# EAGLE design LuMini_8X8 (EAGLE 9.1.0)
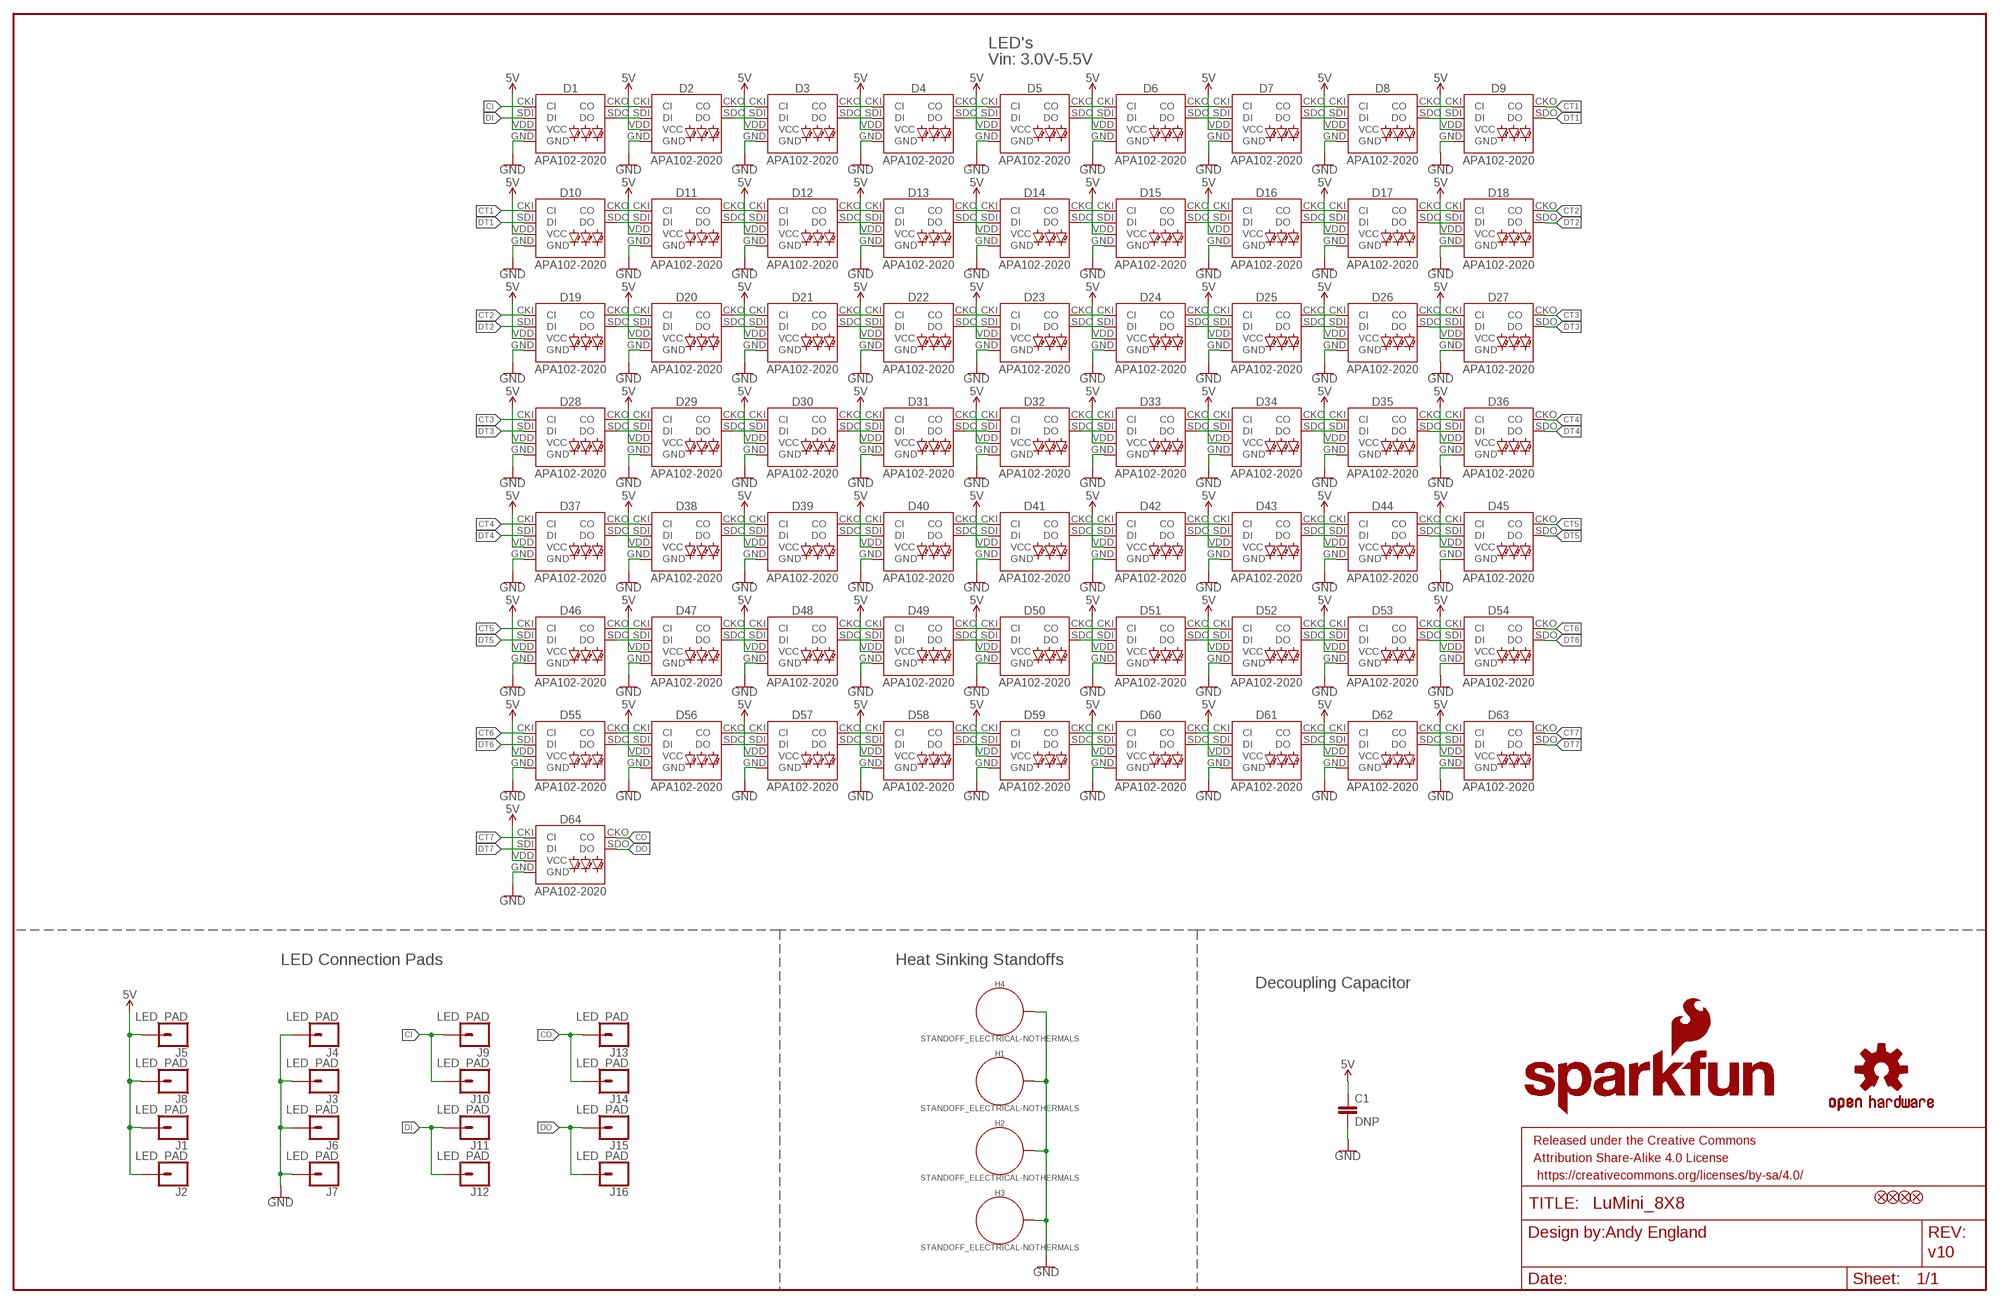
[diagram p0: schematic, sheet 1]

## Parts
C1  DNP  4.7UF-1206-16V-(+80/-20%)  [1206]
D1  APA102-2020  [APA102-2020]
D2  APA102-2020  [APA102-2020]
D3  APA102-2020  [APA102-2020]
D4  APA102-2020  [APA102-2020]
D5  APA102-2020  [APA102-2020]
D6  APA102-2020  [APA102-2020]
D7  APA102-2020  [APA102-2020]
D8  APA102-2020  [APA102-2020]
D9  APA102-2020  [APA102-2020]
D10  APA102-2020  [APA102-2020]
D11  APA102-2020  [APA102-2020]
D12  APA102-2020  [APA102-2020]
D13  APA102-2020  [APA102-2020]
D14  APA102-2020  [APA102-2020]
D15  APA102-2020  [APA102-2020]
D16  APA102-2020  [APA102-2020]
D17  APA102-2020  [APA102-2020]
D18  APA102-2020  [APA102-2020]
D19  APA102-2020  [APA102-2020]
D20  APA102-2020  [APA102-2020]
D21  APA102-2020  [APA102-2020]
D22  APA102-2020  [APA102-2020]
D23  APA102-2020  [APA102-2020]
D24  APA102-2020  [APA102-2020]
D25  APA102-2020  [APA102-2020]
D26  APA102-2020  [APA102-2020]
D27  APA102-2020  [APA102-2020]
D28  APA102-2020  [APA102-2020]
D29  APA102-2020  [APA102-2020]
D30  APA102-2020  [APA102-2020]
D31  APA102-2020  [APA102-2020]
D32  APA102-2020  [APA102-2020]
D33  APA102-2020  [APA102-2020]
D34  APA102-2020  [APA102-2020]
D35  APA102-2020  [APA102-2020]
D36  APA102-2020  [APA102-2020]
D37  APA102-2020  [APA102-2020]
D38  APA102-2020  [APA102-2020]
D39  APA102-2020  [APA102-2020]
D40  APA102-2020  [APA102-2020]
D41  APA102-2020  [APA102-2020]
D42  APA102-2020  [APA102-2020]
D43  APA102-2020  [APA102-2020]
D44  APA102-2020  [APA102-2020]
D45  APA102-2020  [APA102-2020]
D46  APA102-2020  [APA102-2020]
D47  APA102-2020  [APA102-2020]
D48  APA102-2020  [APA102-2020]
D49  APA102-2020  [APA102-2020]
D50  APA102-2020  [APA102-2020]
D51  APA102-2020  [APA102-2020]
D52  APA102-2020  [APA102-2020]
D53  APA102-2020  [APA102-2020]
D54  APA102-2020  [APA102-2020]
D55  APA102-2020  [APA102-2020]
D56  APA102-2020  [APA102-2020]
D57  APA102-2020  [APA102-2020]
D58  APA102-2020  [APA102-2020]
D59  APA102-2020  [APA102-2020]
D60  APA102-2020  [APA102-2020]
D61  APA102-2020  [APA102-2020]
D62  APA102-2020  [APA102-2020]
D63  APA102-2020  [APA102-2020]
D64  APA102-2020  [APA102-2020]
FD1  FIDUCIALUFIDUCIAL  [FIDUCIAL-MICRO]
FD2  FIDUCIALUFIDUCIAL  [FIDUCIAL-MICRO]
FD3  FIDUCIALUFIDUCIAL  [FIDUCIAL-MICRO]
FD4  FIDUCIALUFIDUCIAL  [FIDUCIAL-MICRO]
FRAME1  FRAME-LEDGER  [CREATIVE_COMMONS]
H1  STANDOFF_ELECTRICAL-NOTHERMALS  [STANDOFF-ELECTRICAL-NOTHERMALS]
H2  STANDOFF_ELECTRICAL-NOTHERMALS  [STANDOFF-ELECTRICAL-NOTHERMALS]
H3  STANDOFF_ELECTRICAL-NOTHERMALS  [STANDOFF-ELECTRICAL-NOTHERMALS]
H4  STANDOFF_ELECTRICAL-NOTHERMALS  [STANDOFF-ELECTRICAL-NOTHERMALS]
J1  LED_PAD  [CIRCULARPAD]
J2  LED_PAD  [CIRCULARPAD]
J3  LED_PAD  [CIRCULARPAD]
J4  LED_PAD  [CIRCULARPAD]
J5  LED_PAD  [CIRCULARPAD]
J6  LED_PAD  [CIRCULARPAD]
J7  LED_PAD  [CIRCULARPAD]
J8  LED_PAD  [CIRCULARPAD]
J9  LED_PAD  [CIRCULARPAD]
J10  LED_PAD  [CIRCULARPAD]
J11  LED_PAD  [CIRCULARPAD]
J12  LED_PAD  [CIRCULARPAD]
J13  LED_PAD  [CIRCULARPAD]
J14  LED_PAD  [CIRCULARPAD]
J15  LED_PAD  [CIRCULARPAD]
J16  LED_PAD  [CIRCULARPAD]
LOGO1  SFE_LOGO_NAME_FLAME.1_INCH  [SFE_LOGO_NAME_FLAME_.1]
LOGO2  OSHW-LOGOS  [OSHW-LOGO-S]

## Nets
5V: C1.1 D1.VDD(VCC) D2.VDD(VCC) D3.VDD(VCC) D4.VDD(VCC) D5.VDD(VCC) D6.VDD(VCC) D7.VDD(VCC) D8.VDD(VCC) D9.VDD(VCC) D10.VDD(VCC) D11.VDD(VCC) D12.VDD(VCC) D13.VDD(VCC) D14.VDD(VCC) D15.VDD(VCC) D16.VDD(VCC) D17.VDD(VCC) D18.VDD(VCC) D19.VDD(VCC) D20.VDD(VCC) D21.VDD(VCC) D22.VDD(VCC) D23.VDD(VCC) D24.VDD(VCC) D25.VDD(VCC) D26.VDD(VCC) D27.VDD(VCC) D28.VDD(VCC) D29.VDD(VCC) D30.VDD(VCC) D31.VDD(VCC) D32.VDD(VCC) D33.VDD(VCC) D34.VDD(VCC) D35.VDD(VCC) D36.VDD(VCC) D37.VDD(VCC) D38.VDD(VCC) D39.VDD(VCC) D40.VDD(VCC) D41.VDD(VCC) D42.VDD(VCC) D43.VDD(VCC) D44.VDD(VCC) D45.VDD(VCC) D46.VDD(VCC) D47.VDD(VCC) D48.VDD(VCC) D49.VDD(VCC) D50.VDD(VCC) D51.VDD(VCC) D52.VDD(VCC) D53.VDD(VCC) D54.VDD(VCC) D55.VDD(VCC) D56.VDD(VCC) D57.VDD(VCC) D58.VDD(VCC) D59.VDD(VCC) D60.VDD(VCC) D61.VDD(VCC) D62.VDD(VCC) D63.VDD(VCC) D64.VDD(VCC) J1.P$1 J1.P$2 J2.P$1 J2.P$2 J5.P$1 J5.P$2 J8.P$1 J8.P$2
CI: D1.CKI(CI) J9.P$1 J9.P$2 J10.P$1 J10.P$2
CO: D64.CKO(CO) J13.P$1 J13.P$2 J14.P$1 J14.P$2
CT1: D9.CKO(CO) D10.CKI(CI)
CT2: D18.CKO(CO) D19.CKI(CI)
CT3: D27.CKO(CO) D28.CKI(CI)
CT4: D36.CKO(CO) D37.CKI(CI)
CT5: D45.CKO(CO) D46.CKI(CI)
CT6: D54.CKO(CO) D55.CKI(CI)
CT7: D63.CKO(CO) D64.CKI(CI)
DI: D1.SDI(DI) J11.P$1 J11.P$2 J12.P$1 J12.P$2
DO: D64.SDO(DO) J15.P$1 J15.P$2 J16.P$1 J16.P$2
DT1: D9.SDO(DO) D10.SDI(DI)
DT2: D18.SDO(DO) D19.SDI(DI)
DT3: D27.SDO(DO) D28.SDI(DI)
DT4: D36.SDO(DO) D37.SDI(DI)
DT5: D45.SDO(DO) D46.SDI(DI)
DT6: D54.SDO(DO) D55.SDI(DI)
DT7: D63.SDO(DO) D64.SDI(DI)
GND: C1.2 D1.GND D2.GND D3.GND D4.GND D5.GND D6.GND D7.GND D8.GND D9.GND D10.GND D11.GND D12.GND D13.GND D14.GND D15.GND D16.GND D17.GND D18.GND D19.GND D20.GND D21.GND D22.GND D23.GND D24.GND D25.GND D26.GND D27.GND D28.GND D29.GND D30.GND D31.GND D32.GND D33.GND D34.GND D35.GND D36.GND D37.GND D38.GND D39.GND D40.GND D41.GND D42.GND D43.GND D44.GND D45.GND D46.GND D47.GND D48.GND D49.GND D50.GND D51.GND D52.GND D53.GND D54.GND D55.GND D56.GND D57.GND D58.GND D59.GND D60.GND D61.GND D62.GND D63.GND D64.GND H1.P1 H2.P1 H3.P1 H4.P1 J3.P$1 J3.P$2 J4.P$1 J4.P$2 J6.P$1 J6.P$2 J7.P$1 J7.P$2
N$1: D1.SDO(DO) D2.SDI(DI)
N$2: D1.CKO(CO) D2.CKI(CI)
N$5: D2.SDO(DO) D3.SDI(DI)
N$6: D2.CKO(CO) D3.CKI(CI)
N$7: D3.SDO(DO) D4.SDI(DI)
N$8: D3.CKO(CO) D4.CKI(CI)
N$9: D4.SDO(DO) D5.SDI(DI)
N$10: D4.CKO(CO) D5.CKI(CI)
N$11: D5.SDO(DO) D6.SDI(DI)
N$12: D5.CKO(CO) D6.CKI(CI)
N$13: D6.SDO(DO) D7.SDI(DI)
N$14: D6.CKO(CO) D7.CKI(CI)
N$15: D7.SDO(DO) D8.SDI(DI)
N$16: D7.CKO(CO) D8.CKI(CI)
N$17: D8.SDO(DO) D9.SDI(DI)
N$18: D8.CKO(CO) D9.CKI(CI)
N$21: D10.SDO(DO) D11.SDI(DI)
N$22: D10.CKO(CO) D11.CKI(CI)
N$23: D11.SDO(DO) D12.SDI(DI)
N$24: D11.CKO(CO) D12.CKI(CI)
N$25: D12.SDO(DO) D13.SDI(DI)
N$26: D12.CKO(CO) D13.CKI(CI)
N$27: D13.SDO(DO) D14.SDI(DI)
N$28: D13.CKO(CO) D14.CKI(CI)
N$29: D14.SDO(DO) D15.SDI(DI)
N$30: D14.CKO(CO) D15.CKI(CI)
N$31: D15.SDO(DO) D16.SDI(DI)
N$32: D15.CKO(CO) D16.CKI(CI)
N$33: D16.SDO(DO) D17.SDI(DI)
N$34: D16.CKO(CO) D17.CKI(CI)
N$35: D17.SDO(DO) D18.SDI(DI)
N$36: D17.CKO(CO) D18.CKI(CI)
N$37: D19.SDO(DO) D20.SDI(DI)
N$38: D19.CKO(CO) D20.CKI(CI)
N$39: D20.SDO(DO) D21.SDI(DI)
N$40: D20.CKO(CO) D21.CKI(CI)
N$41: D21.SDO(DO) D22.SDI(DI)
N$42: D21.CKO(CO) D22.CKI(CI)
N$43: D22.SDO(DO) D23.SDI(DI)
N$44: D22.CKO(CO) D23.CKI(CI)
N$45: D23.SDO(DO) D24.SDI(DI)
N$46: D23.CKO(CO) D24.CKI(CI)
N$47: D24.SDO(DO) D25.SDI(DI)
N$48: D24.CKO(CO) D25.CKI(CI)
N$49: D25.SDO(DO) D26.SDI(DI)
N$50: D25.CKO(CO) D26.CKI(CI)
N$51: D26.SDO(DO) D27.SDI(DI)
N$52: D26.CKO(CO) D27.CKI(CI)
N$53: D28.SDO(DO) D29.SDI(DI)
N$54: D28.CKO(CO) D29.CKI(CI)
N$55: D29.SDO(DO) D30.SDI(DI)
N$56: D29.CKO(CO) D30.CKI(CI)
N$57: D30.SDO(DO) D31.SDI(DI)
N$58: D30.CKO(CO) D31.CKI(CI)
N$59: D31.SDO(DO) D32.SDI(DI)
N$60: D31.CKO(CO) D32.CKI(CI)
N$61: D32.SDO(DO) D33.SDI(DI)
N$62: D32.CKO(CO) D33.CKI(CI)
N$63: D33.SDO(DO) D34.SDI(DI)
N$64: D33.CKO(CO) D34.CKI(CI)
N$65: D34.SDO(DO) D35.SDI(DI)
N$66: D34.CKO(CO) D35.CKI(CI)
N$67: D35.SDO(DO) D36.SDI(DI)
N$68: D35.CKO(CO) D36.CKI(CI)
N$69: D37.SDO(DO) D38.SDI(DI)
N$70: D37.CKO(CO) D38.CKI(CI)
N$71: D38.SDO(DO) D39.SDI(DI)
N$72: D38.CKO(CO) D39.CKI(CI)
N$73: D39.SDO(DO) D40.SDI(DI)
N$74: D39.CKO(CO) D40.CKI(CI)
N$75: D40.SDO(DO) D41.SDI(DI)
N$76: D40.CKO(CO) D41.CKI(CI)
N$77: D41.SDO(DO) D42.SDI(DI)
N$78: D41.CKO(CO) D42.CKI(CI)
N$79: D42.SDO(DO) D43.SDI(DI)
N$80: D42.CKO(CO) D43.CKI(CI)
N$81: D43.SDO(DO) D44.SDI(DI)
N$82: D43.CKO(CO) D44.CKI(CI)
N$83: D44.SDO(DO) D45.SDI(DI)
N$84: D44.CKO(CO) D45.CKI(CI)
N$85: D46.SDO(DO) D47.SDI(DI)
N$86: D46.CKO(CO) D47.CKI(CI)
N$87: D47.SDO(DO) D48.SDI(DI)
N$88: D47.CKO(CO) D48.CKI(CI)
N$89: D48.SDO(DO) D49.SDI(DI)
N$90: D48.CKO(CO) D49.CKI(CI)
N$91: D49.SDO(DO) D50.SDI(DI)
N$92: D49.CKO(CO) D50.CKI(CI)
N$93: D50.SDO(DO) D51.SDI(DI)
N$94: D50.CKO(CO) D51.CKI(CI)
N$95: D51.SDO(DO) D52.SDI(DI)
N$96: D51.CKO(CO) D52.CKI(CI)
N$97: D52.SDO(DO) D53.SDI(DI)
N$98: D52.CKO(CO) D53.CKI(CI)
N$99: D53.SDO(DO) D54.SDI(DI)
N$100: D53.CKO(CO) D54.CKI(CI)
N$101: D55.SDO(DO) D56.SDI(DI)
N$102: D55.CKO(CO) D56.CKI(CI)
N$103: D56.SDO(DO) D57.SDI(DI)
N$104: D56.CKO(CO) D57.CKI(CI)
N$105: D57.SDO(DO) D58.SDI(DI)
N$106: D57.CKO(CO) D58.CKI(CI)
N$107: D58.SDO(DO) D59.SDI(DI)
N$108: D58.CKO(CO) D59.CKI(CI)
N$109: D59.SDO(DO) D60.SDI(DI)
N$110: D59.CKO(CO) D60.CKI(CI)
N$111: D60.SDO(DO) D61.SDI(DI)
N$112: D60.CKO(CO) D61.CKI(CI)
N$113: D61.SDO(DO) D62.SDI(DI)
N$114: D61.CKO(CO) D62.CKI(CI)
N$115: D62.SDO(DO) D63.SDI(DI)
N$116: D62.CKO(CO) D63.CKI(CI)

## Notes on the sheet
- LED's
- Vin: 3.0V-5.5V
- LED Connection Pads | Heat Sinking Standoffs
- Decoupling Capacitor
- Andy England
- v10

## Library data of the parts
C1 = SparkFun-Capacitors:4.7UF: 4.7µF ceramic capacitors A capacitor is a passive two-terminal electrical component used to store electrical energy temporarily in an electric field.; PROD_ID: CAP-10300; VALUE: 4.7uF
D1-D64 = SparkFun-LED:APA102: APA102 Addressable RGB LED Used in manufacturing of various products at SparkFun Packages: 5050 2020 SparkFun Products: SparkFun Lumenati Boards <https://www.sparkfun.com/categories/405>; PROD_ID: DIO-13883
FD1-FD4 = SparkFun-Aesthetics:FIDUCIAL: Fiducial Alignment Points Point-of-reference for pick-and-place machines and other optical instruments.
FRAME1 = SparkFun-Aesthetics:FRAME-LEDGER: Schematic Frame - Ledger Standard 11x14 US Ledger frame
H1-H4 = SparkFun-Hardware:STANDOFF_ELECTRICAL: Stand Off Drill holes with an electrical connection. For example, use these to ground your board to a chassis. Example SparkFun Products Screw - Phillips Head (1/4", 4-40, 10 pack) <https://www.sparkfun.com/products/10453> (PRT-10453) Screw - Phillips Head (1/2", 4-40, 10 pack) <https://www.sparkfun.com/products/10452> (PRT-10452) Screw - Phillips Head (3/4", 4-40, 10 pack) <https://www.sparkfun.com/products/10451> (PRT-10451) Screw - Phillips Head (1", 4-40, 10 pack) <https://www.sparkfun.com/products/10450> (PRT-10450)
J1-J16 = SparkFun-Connectors:LED_PAD: LuMini 8X8 Solder Pad
LOGO1 = SparkFun-Aesthetics:SFE_LOGO_NAME_FLAME: SparkFun Font Logo w/ Flame This is the SparkFun full logo. The logo on the schematic will always be the same size; the package variant is the height of the flame part of the logo. Default layer for the logo on the board is tSilk.
LOGO2 = SparkFun-Aesthetics:OSHW-LOGO: Open-Source Hardware (OSHW) Logo This logo indicates the piece of hardware it is found on incorporates a OSHW license and/or adheres to the definition of open source hardware found here: http://freedomdefined.org/OSHW

## Board
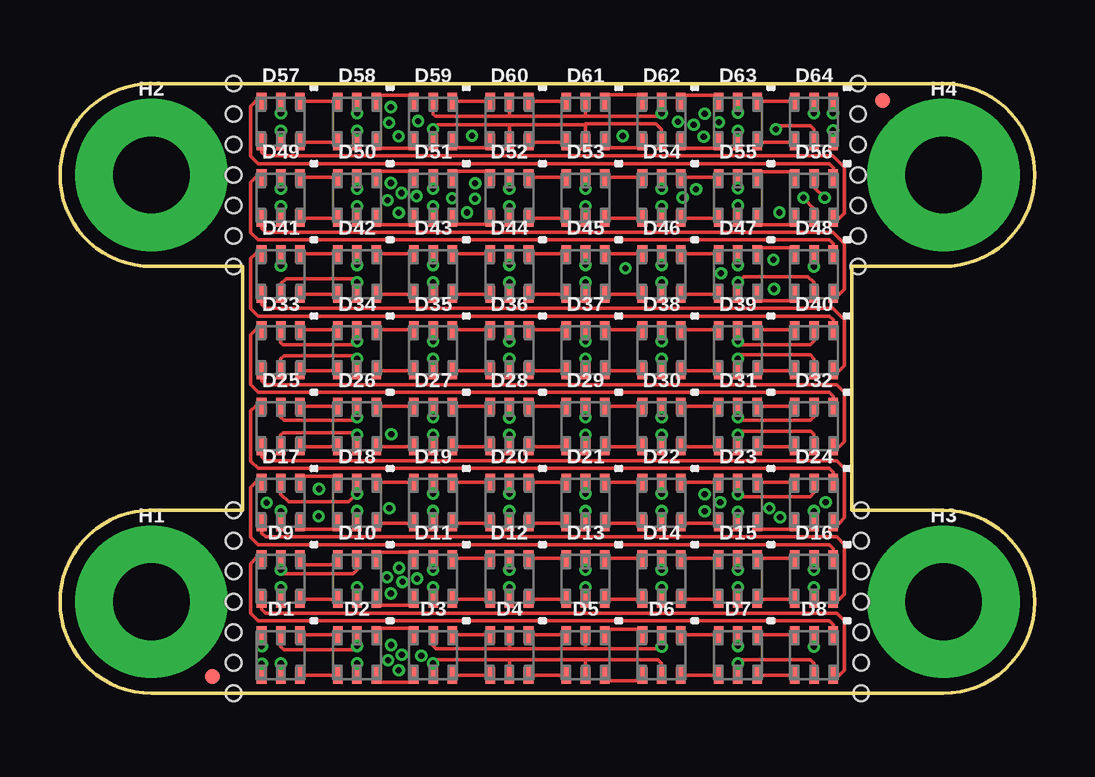
[diagram p1: board, top side]
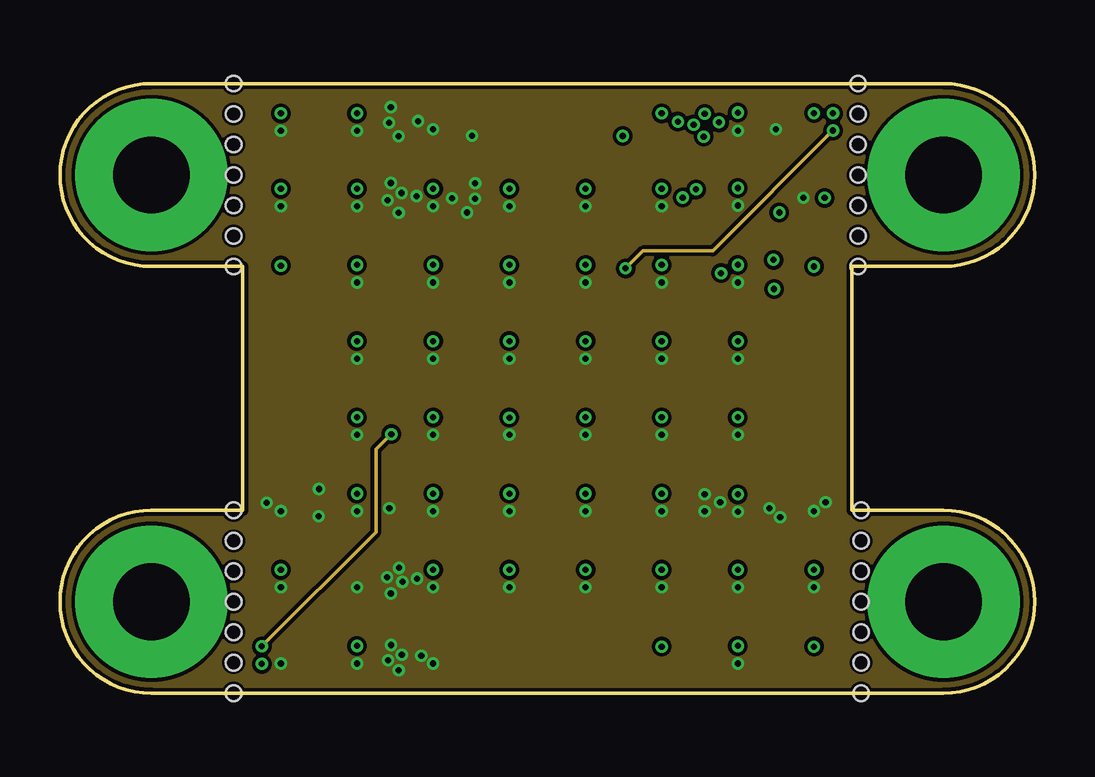
[diagram p2: board, inner layer Route2]
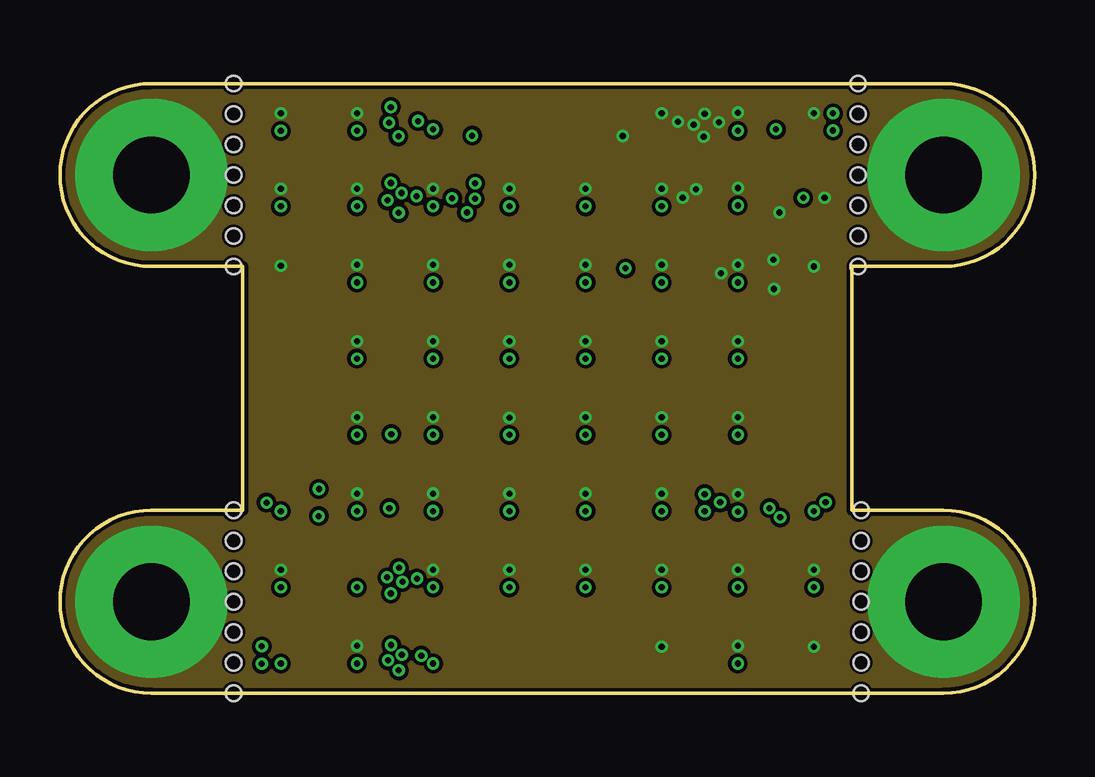
[diagram p3: board, inner layer Route15]
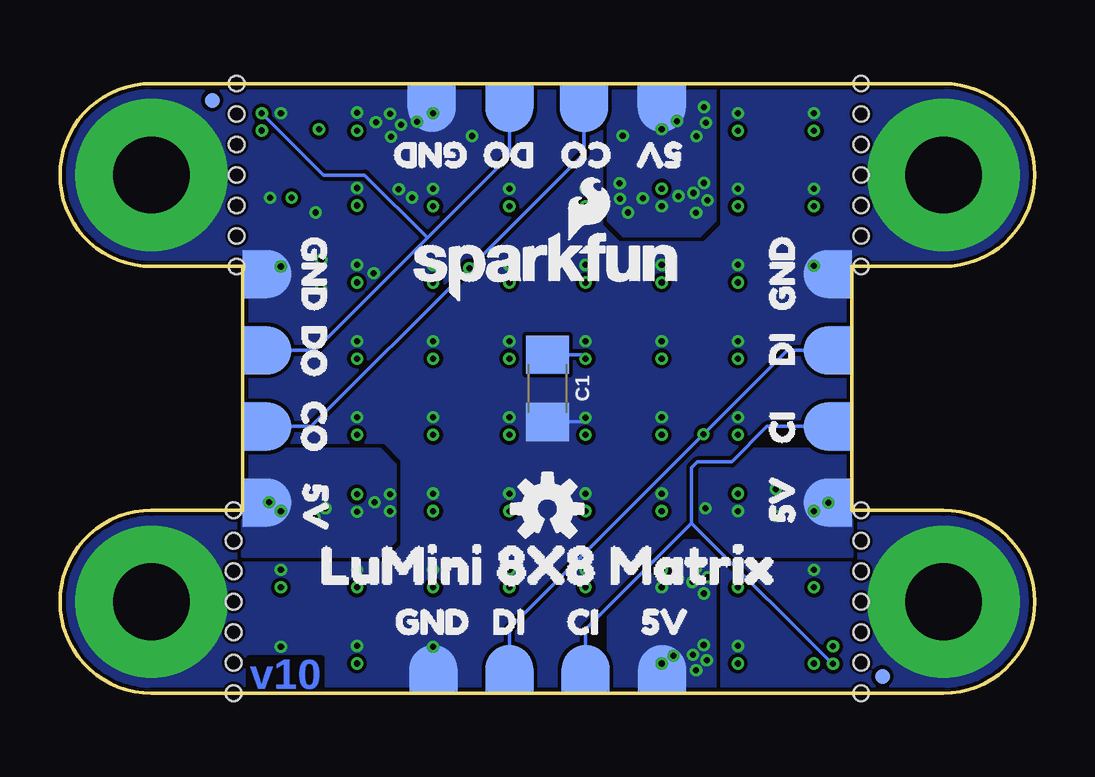
[diagram p4: board, bottom side, seen from below]

Size 40.64 x 25.4 mm. Coordinates in mm from the lower left corner, seen from the top.
Outline: 3.81,0 36.83,0 arc90 40.64,3.81 arc90 36.83,7.62 33.02,7.62 33.02,17.78 36.83,17.78 arc90 40.64,21.59 arc90 36.83,25.4 3.81,25.4 arc90 0,21.59 arc90 3.81,17.78 7.62,17.78 7.62,7.62 3.81,7.62 arc90 0,3.81 arc90 3.81,0
Copper layers (1*2*15*16): Top 0.035559375mm / dielectric 0.47751875mm / Route2 0.035559375mm / dielectric 0.47751875mm / Route15 0.035559375mm / dielectric 0.47751875mm / Bottom 0.035559375mm
Design rules "SparkFun-4-layer-FAB-LIMIT *": minimum track width 6mil, minimum drill 6mil, track to track 6mil, track to pad 6mil, pad to pad 6mil, via to via 6mil, smd to smd 6mil, copper to edge 6mil, drill to drill 6mil, minimum pad ring 5mil, minimum via ring 5mil, stop-mask expansion 1mil, vias tented up to drill 25mil, thermal gap 10mil
Holes 0.64 mm at 7.24,21.59 7.24,22.86 7.24,24.13 7.24,25.4 7.24,20.32 7.24,19.05 7.24,17.78 7.24,3.81 7.24,5.08 7.24,6.35 7.24,7.62 7.24,2.54 7.24,1.27 7.24,0 33.27,21.59 33.27,22.86 33.27,24.13 33.27,25.4 33.27,20.32 33.27,19.05 33.27,17.78 33.4,3.81 33.4,5.08 33.4,6.35 33.4,7.62 33.4,2.54 33.4,1.27 33.4,0

### Footprints (pad centres in the part's own frame; a part is rotated, then mirrored left to right if it is on the bottom)
1206 = smd 1.6 x 1.8: 1 -1.4,0; 2 1.4,0
APA102-2020 = smd 0.4 x 0.7: CKI -0.8,-0.85; CKO 0.8,-0.85; GND 0,0.85; SDI -0.8,0.85; SDO 0.8,0.85; VDD 0,-0.85
FIDUCIAL-MICRO = smd 0.635 x 0.635: 1 0,0
STANDOFF-ELECTRICAL-NOTHERMALS = drill 3.2 pad 6.35: P1 0,0
CIRCULARPAD = smd 2 x 2: P$1 0,0 | smd 2.007 x 1.016: P$2 0,-0.508

### Placement (x,y rotation side)
C1  20.32,12.7 270 bottom
D1  9.21,1.59 0 top
D2  12.38,1.59 0 top
D3  15.56,1.59 0 top
D4  18.73,1.59 0 top
D5  21.91,1.59 0 top
D6  25.08,1.59 0 top
D7  28.26,1.59 0 top
D8  31.43,1.59 0 top
D9  9.21,4.76 0 top
D10  12.38,4.76 0 top
D11  15.56,4.76 0 top
D12  18.73,4.76 0 top
D13  21.91,4.76 0 top
D14  25.08,4.76 0 top
D15  28.26,4.76 0 top
D16  31.43,4.76 0 top
D17  9.21,7.94 0 top
D18  12.38,7.94 0 top
D19  15.56,7.94 0 top
D20  18.73,7.94 0 top
D21  21.91,7.94 0 top
D22  25.08,7.94 0 top
D23  28.26,7.94 0 top
D24  31.43,7.94 0 top
D25  9.21,11.11 0 top
D26  12.38,11.11 0 top
D27  15.56,11.11 0 top
D28  18.73,11.11 0 top
D29  21.91,11.11 0 top
D30  25.08,11.11 0 top
D31  28.26,11.11 0 top
D32  31.43,11.11 0 top
D33  9.21,14.29 0 top
D34  12.38,14.29 0 top
D35  15.56,14.29 0 top
D36  18.73,14.29 0 top
D37  21.91,14.29 0 top
D38  25.08,14.29 0 top
D39  28.26,14.29 0 top
D40  31.43,14.29 0 top
D41  9.21,17.46 0 top
D42  12.38,17.46 0 top
D43  15.56,17.46 0 top
D44  18.73,17.46 0 top
D45  21.91,17.46 0 top
D46  25.08,17.46 0 top
D47  28.26,17.46 0 top
D48  31.43,17.46 0 top
D49  9.21,20.64 0 top
D50  12.38,20.64 0 top
D51  15.56,20.64 0 top
D52  18.73,20.64 0 top
D53  21.91,20.64 0 top
D54  25.08,20.64 0 top
D55  28.26,20.64 0 top
D56  31.43,20.64 0 top
D57  9.21,23.81 0 top
D58  12.38,23.81 0 top
D59  15.56,23.81 0 top
D60  18.73,23.81 0 top
D61  21.91,23.81 0 top
D62  25.08,23.81 0 top
D63  28.26,23.81 0 top
D64  31.43,23.81 0 top
FD1  6.35,0.7 0 top
FD2  6.35,0.7 0 bottom
FD3  34.29,24.7 0 top
FD4  34.29,24.7 0 bottom
FRAME1  20.32,-8.89 0 top  (outside the outline)
H1  3.81,3.81 0 top
H2  3.81,21.59 0 top
H3  36.83,3.81 0 top
H4  36.83,21.59 0 top
J1  8.64,7.94 90 bottom
J2  32,7.94 270 bottom
J3  8.64,17.46 90 bottom
J4  32,17.46 270 bottom
J5  15.54,1.02 0 bottom
J6  25.15,24.38 180 bottom
J7  25.07,1.02 0 bottom
J8  15.56,24.38 180 bottom
J9  8.64,11.11 90 bottom
J10  18.73,1.02 0 bottom
J11  8.64,14.29 90 bottom
J12  21.91,1.02 0 bottom
J13  32,11.11 270 bottom
J14  18.8,24.38 180 bottom
J15  32,14.29 270 bottom
J16  21.91,24.38 180 bottom
LOGO1  20.32,17.78 0 bottom
LOGO2  20.32,7.68 0 bottom
U$1  [5V5]  17.31,2.98 0 bottom
U$2  [5V5]  13.79,22.42 180 bottom
U$3  [CI1]  20.42,2.98 0 bottom
U$4  [CO3]  16.78,22.42 180 bottom
U$5  [DI2]  23.53,2.98 0 bottom
U$6  [DO4]  19.95,22.42 180 bottom
U$7  [GND6]  22.77,22.42 180 bottom
U$8  [GND6]  27.56,2.98 0 bottom
U$9  [LUMINI_8X8_MATRIX0]  31.18,5.33 0 bottom
U$10  [ORDERING_INSTRUCTIONS]  6.35,-11.43 0 top  (outside the outline)
U$11  [5V5]  10.54,6.18 90 bottom
U$12  [CI1]  10.54,9.49 90 bottom
U$13  [DI2]  10.54,12.73 90 bottom
U$14  [GND6]  10.54,15.05 90 bottom
U$15  [GND6]  30.04,19.9 270 bottom
U$16  [DO4]  30.04,16.24 270 bottom
U$17  [CO3]  30.04,13.07 270 bottom
U$18  [5V5]  29.97,9.64 270 bottom

### Tracks (layer width: path | path; a pad name or v marks a point on that pad's centre or on a via)
5V  (via drill 0.25)
  Top 0.152: D56.VDD 31.43,20.19 v30.99,20.64 | v28.26,20.32 D55.VDD | D64.VDD 31.43,23.5 31.27,23.65 30,23.65 v29.84,23.5 | D63.VDD v28.26,23.43 | D62.VDD 25.08,23.5 24.85,23.72 21.91,23.72 21.91,23.69 | 18.73,23.69 15.75,23.69 v15.56,23.5 D59.VDD | 18.73,23.69 21.91,23.69 | D60.VDD 18.73,23.69 | D58.VDD v12.38,23.43 | D57.VDD v9.21,23.43 | D49.VDD v9.21,20.29 | D48.VDD 31.43,17.11 31.18,17.36 28.5,17.36 v28.26,17.11 D47.VDD | D41.VDD 9.21,17.05 9.43,17.27 12.22,17.27 v12.38,17.11 D42.VDD | D34.VDD v12.38,13.94 12.26,14.06 9.34,14.06 9.21,13.94 D33.VDD | D26.VDD v12.38,10.76 12.29,10.86 9.3,10.86 9.21,10.76 D25.VDD | D17.VDD v9.21,7.59 | D2.VDD v12.38,1.24 | D3.VDD v15.56,1.24 15.72,1.4 18.73,1.4 | 18.73,1.4 21.91,1.4 | 21.91,1.4 24.92,1.4 25.08,1.24 D6.VDD | D4.VDD 18.73,1.4 | D18.VDD v12.38,7.59 | D9.VDD v9.21,4.41 | D10.VDD v12.38,4.41 | D7.VDD v28.26,1.24 28.42,1.4 31.27,1.4 31.43,1.24 D8.VDD | D11.VDD v15.56,4.41 | D12.VDD v18.73,4.41 | D15.VDD v28.26,4.41 | D16.VDD v31.43,4.41 | D14.VDD v25.08,4.41 | D13.VDD v21.91,4.41 | D19.VDD v15.56,7.59 | D20.VDD v18.73,7.59 | D21.VDD v21.91,7.59 | D22.VDD v25.08,7.59 | D23.VDD v28.26,7.56 | D24.VDD v31.43,7.59 | D31.VDD v28.26,10.76 28.42,10.92 31.3,10.92 31.43,10.79 D32.VDD | D30.VDD v25.08,10.76 | D29.VDD v21.91,10.76 | D28.VDD v18.73,10.76 | D27.VDD v15.56,10.76 | D35.VDD v15.56,13.94 | D36.VDD v18.73,13.94 | D37.VDD v21.91,13.94 | D38.VDD v25.08,13.94 | D39.VDD v28.26,13.94 28.42,14.1 31.27,14.1 31.43,13.94 D40.VDD | D46.VDD v25.08,17.11 | D45.VDD v21.91,17.11 | D44.VDD v18.73,17.11 | D43.VDD v15.56,17.11 | D50.VDD v12.38,20.29 | D51.VDD v15.56,20.29 | D52.VDD v18.73,20.29 | D53.VDD v21.91,20.29 | D54.VDD v25.08,20.29
  Top 0.152: D1.VDD v9.21,1.24 | 21.91,1.4 D5.VDD | D61.VDD 21.91,23.69
  Bottom 0.152: v15.56,1.24 15.56,1.03 J5.P$1 J5.P$2 | J2.P$2 J2.P$1 31.78,7.94 v31.43,7.59 | J8.P$1 J8.P$2 v15.56,23.5 | v18.73,13.94 18.89,14.1 C1.1 | J1.P$2 J1.P$1 8.86,7.94 v9.21,7.59
  other vias: 30.02,7.33 29.58,7.71 31.92,7.95 27.52,7.95 26.87,8.29 26.87,7.58 15.06,1.56 14.12,0.95 13.68,1.37 14.25,1.6 13.8,2.01 13.79,4.15 14.88,4.78 14.27,4.64 13.64,4.83 14.14,5.22 10.78,7.38 10.79,8.51 8.61,7.94 14.92,23.84 13.79,24.42 13.72,23.77 14.11,23.2 17.18,23.23 16.97,20.03 17.3,20.6 16.34,20.62 17.31,21.25 13.79,21.26 14.86,20.71 14.24,20.84 13.65,20.54 14.12,20.02 13.73,7.71
  pour Route2: 0,25.4 40.64,25.4 40.64,0 0,0
  pour Bottom (no thermals): 13.34,25.4 13.34,19.68 13.97,19.05 17.14,19.05 17.78,19.68 17.78,25.4
  pour Bottom (no thermals): 7.62,5.71 13.34,5.71 13.97,6.35 13.97,9.53 13.34,10.16 7.62,10.16
  pour Bottom (no thermals): 17.78,0 17.78,5.71 17.14,6.35 13.97,6.35 13.34,5.71 13.34,0
  pour Bottom (no thermals): 33.02,10.16 27.3,10.16 26.67,9.53 26.67,6.35 27.3,5.71 33.02,5.71
CI  (via drill 0.25)
  Top 0.152: D1.CKI v8.41,1.22
  Bottom 0.152: J9.P$1 10.32,11.11 | 13.77,6.55 8.45,1.22 v8.41,1.22 | 13.77,6.55 14.29,7.06 | 10.32,11.11 J9.P$2 | J10.P$2 18.73,1.11 J10.P$1 18.73,2.67 14.31,7.09 | 10.32,11.11 11.16,11.11 12.64,9.64 14.07,9.64 14.31,9.4 14.31,7.09 | 14.31,7.09 13.77,6.55
CO  (via drill 0.25)
  Top 0.152: D64.CKO v32.23,23.44 v32.23,23.45
  Route2 0.152: v32.23,23.45 27.21,18.43 24.3,18.43 v23.57,17.7
  Bottom 0.152: J13.P$2 J13.P$1 30.16,11.11 v23.57,17.7 18.8,22.48 J14.P$1 J14.P$2
CT1
  Top 0.152: D9.CKO D10.CKI
CT2
  Top 0.152: D19.CKI D18.CKO
CT3
  Top 0.152: D27.CKO D28.CKI
CT4
  Top 0.152: D36.CKO D37.CKI
CT5
  Top 0.152: D45.CKO D46.CKI
CT6
  Top 0.152: D55.CKI D54.CKO
CT7
  Top 0.152: D63.CKO D64.CKI
DI  (via drill 0.25)
  Top 0.152: D1.SDI v8.41,1.96 v8.41,1.95
  Route2 0.152: v8.41,1.95 13.18,6.71 13.18,10.16 v13.81,10.79
  Bottom 0.152: J11.P$2 J11.P$1 10.32,14.29 v13.81,10.79 21.91,2.7 21.91,1.59 | 21.91,1.11 21.91,1.59 | J12.P$2 21.91,0.79 | J12.P$2 21.91,0.79 | 21.91,0.79 21.91,0.95 | 21.91,0.95 21.91,1.11 | 21.91,1.11 21.91,1.59 | 21.91,0.95 J12.P$1 21.91,1.11 | 21.91,0.95 21.91,0.79 | J12.P$2 21.91,0.95
DO  (via drill 0.25)
  Top 0.152: D64.SDO v32.23,24.17 v32.23,24.16
  Bottom 0.152: 25.32,18.97 30,14.29 J15.P$1 J15.P$2 | 25.32,18.97 21.91,22.38 J16.P$1 J16.P$2 | v32.23,24.16 29.65,21.59 27.94,21.59 25.32,18.97
DT1
  Top 0.152: D9.SDO 10.01,5.5 10.16,5.35 11.48,5.35 11.58,5.45 D10.SDI
DT2
  Top 0.152: D19.SDI D18.SDO
DT3
  Top 0.152: D28.SDI D27.SDO
DT4
  Top 0.152: D36.SDO D37.SDI
DT5
  Top 0.152: D46.SDI D45.SDO
DT6
  Top 0.152: D54.SDO D55.SDI
DT7
  Top 0.152: D64.SDI D63.SDO
GND  (via drill 0.25)
  Top 0.152: D56.GND 31.43,21.08 v31.88,20.64 | D55.GND v28.26,21.05 | D63.GND v28.26,24.19 | D61.GND 21.91,24.13 21.91,24.04 | D58.GND v12.38,24.16 | D57.GND v9.21,24.16 | D49.GND v9.21,21.02 | D59.GND 15.56,24.13 15.65,24.04 18.73,24.04 | D60.GND 18.73,24.04 | D48.GND v31.43,17.78 | D41.GND v9.21,17.81 | D34.GND v12.38,14.67 12.22,14.51 9.3,14.51 9.21,14.61 D33.GND | D26.GND v12.38,11.49 12.26,11.37 9.34,11.37 9.21,11.49 D25.GND | D2.GND v12.38,1.97 12.22,1.81 9.34,1.81 9.21,1.94 D1.GND | D6.GND v25.08,1.94 24.99,1.84 21.91,1.84 | D3.GND 15.56,1.97 15.68,1.84 18.73,1.84 | 18.73,1.84 21.91,1.84 | 21.91,1.84 D5.GND | 18.73,1.84 D4.GND | D18.GND v12.38,8.32 12.03,7.97 9.53,7.97 9.21,8.29 D17.GND | D9.GND v9.21,5.14 9.37,4.99 12.22,4.99 12.38,5.14 D10.GND | D8.GND v31.43,1.94 | D7.GND v28.26,1.97 | D12.GND v18.73,5.14 | D11.GND v15.56,5.14 | D13.GND v21.91,5.14 | D14.GND v25.08,5.14 | D15.GND v28.26,5.14 | D16.GND v31.43,5.14 | D23.GND v28.26,8.29 28.35,8.19 29.94,8.19 31.27,8.19 31.43,8.35 D24.GND | D22.GND v25.08,8.32 | D21.GND v21.91,8.32 | D19.GND v15.56,8.32 | D20.GND v18.73,8.32 | D31.GND v28.26,11.49 28.38,11.37 31.27,11.37 31.43,11.53 D32.GND | D30.GND v25.08,11.49 | D29.GND v21.91,11.49 | D39.GND v28.26,14.67 28.42,14.51 31.27,14.51 31.43,14.67 D40.GND | D38.GND v25.08,14.67 | D37.GND v21.91,14.67 | D36.GND v18.73,14.67 | D35.GND v15.56,14.67 | D42.GND v12.38,17.84 | D43.GND v15.56,17.84 | D44.GND v18.73,17.84 | D45.GND v21.91,17.84 | D46.GND v25.08,17.84 | D47.GND v28.26,17.84 | D50.GND v12.38,21.02 | D51.GND v15.56,21.02 | D52.GND v18.73,21.02 | D53.GND v21.91,21.02 | D54.GND v25.08,21.02 | D64.GND v31.43,24.17 | D28.GND v18.73,11.48 | D62.GND v25.08,24.16 24.96,24.04 21.91,24.04
  Top 0.152: 21.91,24.04 18.73,24.04 | D27.GND v15.56,11.49
  Bottom 0.152: v31.43,17.78 31.75,17.46 J4.P$1 J4.P$2 | J3.P$2 J3.P$1 8.98,17.81 v9.21,17.81 | J7.P$2 J7.P$1 25.07,1.92 v25.08,1.94 | v18.73,11.48 18.91,11.3 C1.2 | J6.P$1 J6.P$2 25.15,24.23 v25.08,24.16
  other vias: 29.74,18.06 29.77,16.84 27.56,17.5 29.98,20.03 25.96,20.65 26.52,20.99 26.87,24.14 27.47,23.79 25.76,23.81 26.42,23.69 26.84,23.19 23.46,23.22
  pour Bottom (rank 2, no thermals): 0,25.4 40.64,25.4 40.64,0 0,0
  pour Route15: 0,25.4 40.64,25.4 40.64,0 0,0
N$1
  Top 0.152: D1.SDO D2.SDI
N$2
  Top 0.152: D1.CKO D2.CKI
N$5
  Top 0.152: D2.SDO 13.18,2.7 14.63,2.7 14.76,2.58 D3.SDI
N$6
  Top 0.152: D2.CKO 13.18,0.57 13.3,0.46 14.68,0.46 14.76,0.53 D3.CKI
N$7
  Top 0.152: D3.SDO D4.SDI
N$8
  Top 0.152: D4.CKI D3.CKO
N$9
  Top 0.152: D4.SDO D5.SDI
N$10
  Top 0.152: D5.CKI D4.CKO
N$11
  Top 0.152: D5.SDO 22.93,2.66 24.06,2.66 D6.SDI
N$12
  Top 0.152: D6.CKI 24.06,0.52 22.93,0.52 D5.CKO
N$13
  Top 0.152: D6.SDO D7.SDI
N$14
  Top 0.152: D7.CKI D6.CKO
N$15
  Top 0.152: D7.SDO D8.SDI
N$16
  Top 0.152: D8.CKI D7.CKO
N$17
  Top 0.152: D8.SDO 32.23,2.85 32.07,3.02 8.26,3.02 7.94,3.33 7.94,5.4 8.15,5.61 D9.SDI
N$18
  Top 0.152: D8.CKO 32.49,0.74 32.7,0.95 32.7,3.02 32.38,3.33 8.57,3.33 8.41,3.5 D9.CKI
N$21
  Top 0.152: D11.SDI 14.76,5.82 14.71,5.87 13.22,5.87 13.18,5.83 D10.SDO
N$22
  Top 0.152: D11.CKI 14.76,3.66 13.23,3.66 13.18,3.71 D10.CKO
N$23
  Top 0.152: D11.SDO D12.SDI
N$24
  Top 0.152: D12.CKI D11.CKO
N$25
  Top 0.152: D12.SDO D13.SDI
N$26
  Top 0.152: D13.CKI D12.CKO
N$27
  Top 0.152: D13.SDO D14.SDI
N$28
  Top 0.152: D14.CKI D13.CKO
N$29
  Top 0.152: D14.SDO D15.SDI
N$30
  Top 0.152: D15.CKI D14.CKO
N$31
  Top 0.152: D15.SDO D16.SDI
N$32
  Top 0.152: D16.CKI D15.CKO
N$33
  Top 0.152: D16.SDO 32.23,6.03 32.07,6.19 8.26,6.19 7.95,6.49 7.95,8.59 8.15,8.79 D17.SDI
N$34
  Top 0.152: D16.CKO 32.49,3.91 32.7,4.13 32.7,6.19 32.38,6.51 8.57,6.51 8.41,6.67 D17.CKI
N$35
  Top 0.152: D17.SDO 10.01,8.99 10.06,9.04 11.53,9.04 11.58,8.99 D18.SDI
N$36
  Top 0.152: D18.CKI 11.58,6.87 11.54,6.83 10.1,6.83 10.01,6.92 D17.CKO
N$37
  Top 0.152: D20.SDI D19.SDO
N$38
  Top 0.152: D20.CKI D19.CKO
N$39
  Top 0.152: D21.SDI D20.SDO
N$40
  Top 0.152: D21.CKI D20.CKO
N$41
  Top 0.152: D22.SDI D21.SDO
N$42
  Top 0.152: D22.CKI D21.CKO
N$43
  Top 0.152: D23.SDI D22.SDO
N$44
  Top 0.152: D22.CKO D23.CKI
N$45
  Top 0.152: D24.SDI D23.SDO
N$46
  Top 0.152: D23.CKO 29.06,6.96 29.18,6.83 30.51,6.83 30.63,6.96 D24.CKI
N$47
  Top 0.152: D24.SDO 32.23,9.2 32.07,9.37 8.26,9.37 7.95,9.67 7.95,11.76 8.15,11.96 D25.SDI
N$48
  Top 0.152: D24.CKO 32.49,7.09 32.7,7.3 32.7,9.37 32.38,9.68 8.57,9.68 8.41,9.85 D25.CKI
N$49
  Top 0.152: D26.SDI D25.SDO
N$50
  Top 0.152: D25.CKO D26.CKI
N$51
  Top 0.152: D27.SDI D26.SDO
N$52
  Top 0.152: D26.CKO D27.CKI
N$53
  Top 0.152: D29.SDI D28.SDO
N$54
  Top 0.152: D28.CKO D29.CKI
N$55
  Top 0.152: D30.SDI D29.SDO
N$56
  Top 0.152: D29.CKO D30.CKI
N$57
  Top 0.152: D30.SDO D31.SDI
N$58
  Top 0.152: D31.CKI D30.CKO
N$59
  Top 0.152: D31.SDO D32.SDI
N$60
  Top 0.152: D31.CKO D32.CKI
N$61
  Top 0.152: D32.SDO 32.23,12.38 32.07,12.54 8.26,12.54 7.95,12.84 7.95,14.94 8.15,15.14 D33.SDI
N$62
  Top 0.152: D32.CKO 32.49,10.26 32.7,10.48 32.7,12.54 32.38,12.86 8.57,12.86 8.41,13.02 D33.CKI
N$63
  Top 0.152: D33.SDO D34.SDI
N$64
  Top 0.152: D33.CKO D34.CKI
N$65
  Top 0.152: D34.SDO D35.SDI
N$66
  Top 0.152: D34.CKO D35.CKI
N$67
  Top 0.152: D35.SDO D36.SDI
N$68
  Top 0.152: D35.CKO D36.CKI
N$69
  Top 0.152: D37.SDO D38.SDI
N$70
  Top 0.152: D38.CKI D37.CKO
N$71
  Top 0.152: D38.SDO D39.SDI
N$72
  Top 0.152: D38.CKO D39.CKI
N$73
  Top 0.152: D39.SDO D40.SDI
N$74
  Top 0.152: D40.CKI D39.CKO
N$75
  Top 0.152: D40.SDO 32.23,15.55 32.07,15.72 8.26,15.72 7.95,16.02 7.95,18.11 8.15,18.31 D41.SDI
N$76
  Top 0.152: D41.CKI 8.41,16.2 8.57,16.03 32.23,16.03 32.7,15.56 32.7,13.65 32.49,13.44 D40.CKO
N$77
  Top 0.152: D41.SDO D42.SDI
N$78
  Top 0.152: D42.CKI D41.CKO
N$79
  Top 0.152: D42.SDO D43.SDI
N$80
  Top 0.152: D43.CKI D42.CKO
N$81
  Top 0.152: D44.SDI D43.SDO
N$82
  Top 0.152: D43.CKO D44.CKI
N$83
  Top 0.152: D45.SDI D44.SDO
N$84
  Top 0.152: D44.CKO D45.CKI
N$85
  Top 0.152: D47.SDI D46.SDO
N$86
  Top 0.152: D46.CKO D47.CKI
N$87
  Top 0.152: D47.SDO 29.06,18.44 29.18,18.57 30.56,18.57 30.63,18.49 D48.SDI
N$88
  Top 0.152: D48.CKI 30.63,16.35 29.18,16.35 29.06,16.47 D47.CKO
N$89
  Top 0.152: D48.SDO 32.23,18.73 32.07,18.89 8.26,18.89 7.95,19.19 7.95,21.29 8.15,21.49 D49.SDI
N$90
  Top 0.152: D49.CKI 8.41,19.37 8.57,19.21 32.23,19.21 32.7,18.73 32.7,16.83 32.49,16.61 D48.CKO
N$91
  Top 0.152: D50.SDI D49.SDO
N$92
  Top 0.152: D49.CKO D50.CKI
N$93
  Top 0.152: D50.SDO 13.18,21.68 13.26,21.75 14.72,21.75 14.76,21.72 D51.SDI
N$94
  Top 0.152: D50.CKO 13.18,19.56 13.22,19.52 14.74,19.52 14.76,19.53 D51.CKI
N$95
  Top 0.152: D51.SDO 16.36,21.65 16.45,21.74 17.83,21.74 17.93,21.64 D52.SDI
N$96
  Top 0.152: D52.CKI 17.93,19.53 16.47,19.53 16.36,19.65 D51.CKO
N$97
  Top 0.152: D52.SDO D53.SDI
N$98
  Top 0.152: D53.CKI D52.CKO
N$99
  Top 0.152: D53.SDO D54.SDI
N$100
  Top 0.152: D54.CKI D53.CKO
N$101
  Top 0.152: D55.SDO 29.06,21.66 29.12,21.73 30.59,21.73 30.63,21.69 D56.SDI
N$102
  Top 0.152: D55.CKO 29.06,19.52 30.57,19.52 30.63,19.58 D56.CKI
N$103
  Top 0.152: D56.SDO 32.23,21.9 32.07,22.07 8.26,22.07 7.95,22.37 7.95,24.46 8.15,24.66 D57.SDI
N$104
  Top 0.152: D57.CKI 8.41,22.55 8.57,22.38 32.23,22.38 32.7,21.91 32.7,20 32.49,19.79 D56.CKO
N$105
  Top 0.152: D58.SDI D57.SDO
N$106
  Top 0.152: D57.CKO D58.CKI
N$107
  Top 0.152: D59.SDI 14.76,24.82 14.66,24.92 13.26,24.92 13.18,24.84 D58.SDO
N$108
  Top 0.152: D58.CKO 13.18,22.77 13.25,22.71 14.71,22.71 14.76,22.76 D59.CKI
N$109
  Top 0.152: D60.SDI D59.SDO
N$110
  Top 0.152: D59.CKO 16.36,22.8 16.42,22.73 17.89,22.73 17.89,22.92 D60.CKI
N$111
  Top 0.152: D61.SDI D60.SDO
N$112
  Top 0.152: D60.CKO D61.CKI
N$113
  Top 0.152: D61.SDO 22.71,24.83 22.81,24.93 24.18,24.93 24.28,24.83 D62.SDI
N$114
  Top 0.152: D61.CKO 22.71,22.73 22.72,22.72 24.17,22.72 24.28,22.84 D62.CKI
N$115
  Top 0.152: D62.SDO 25.88,24.82 25.98,24.92 27.41,24.92 27.46,24.87 D63.SDI
N$116
  Top 0.152: D63.CKI 27.46,22.7 25.92,22.7 25.88,22.73 D62.CKO

### Text on the board
Bottom: v10
tDocu: Andy England | Black PCB / 4 layer board